# EAGLE design #1 v1 (EAGLE 9.7.0)
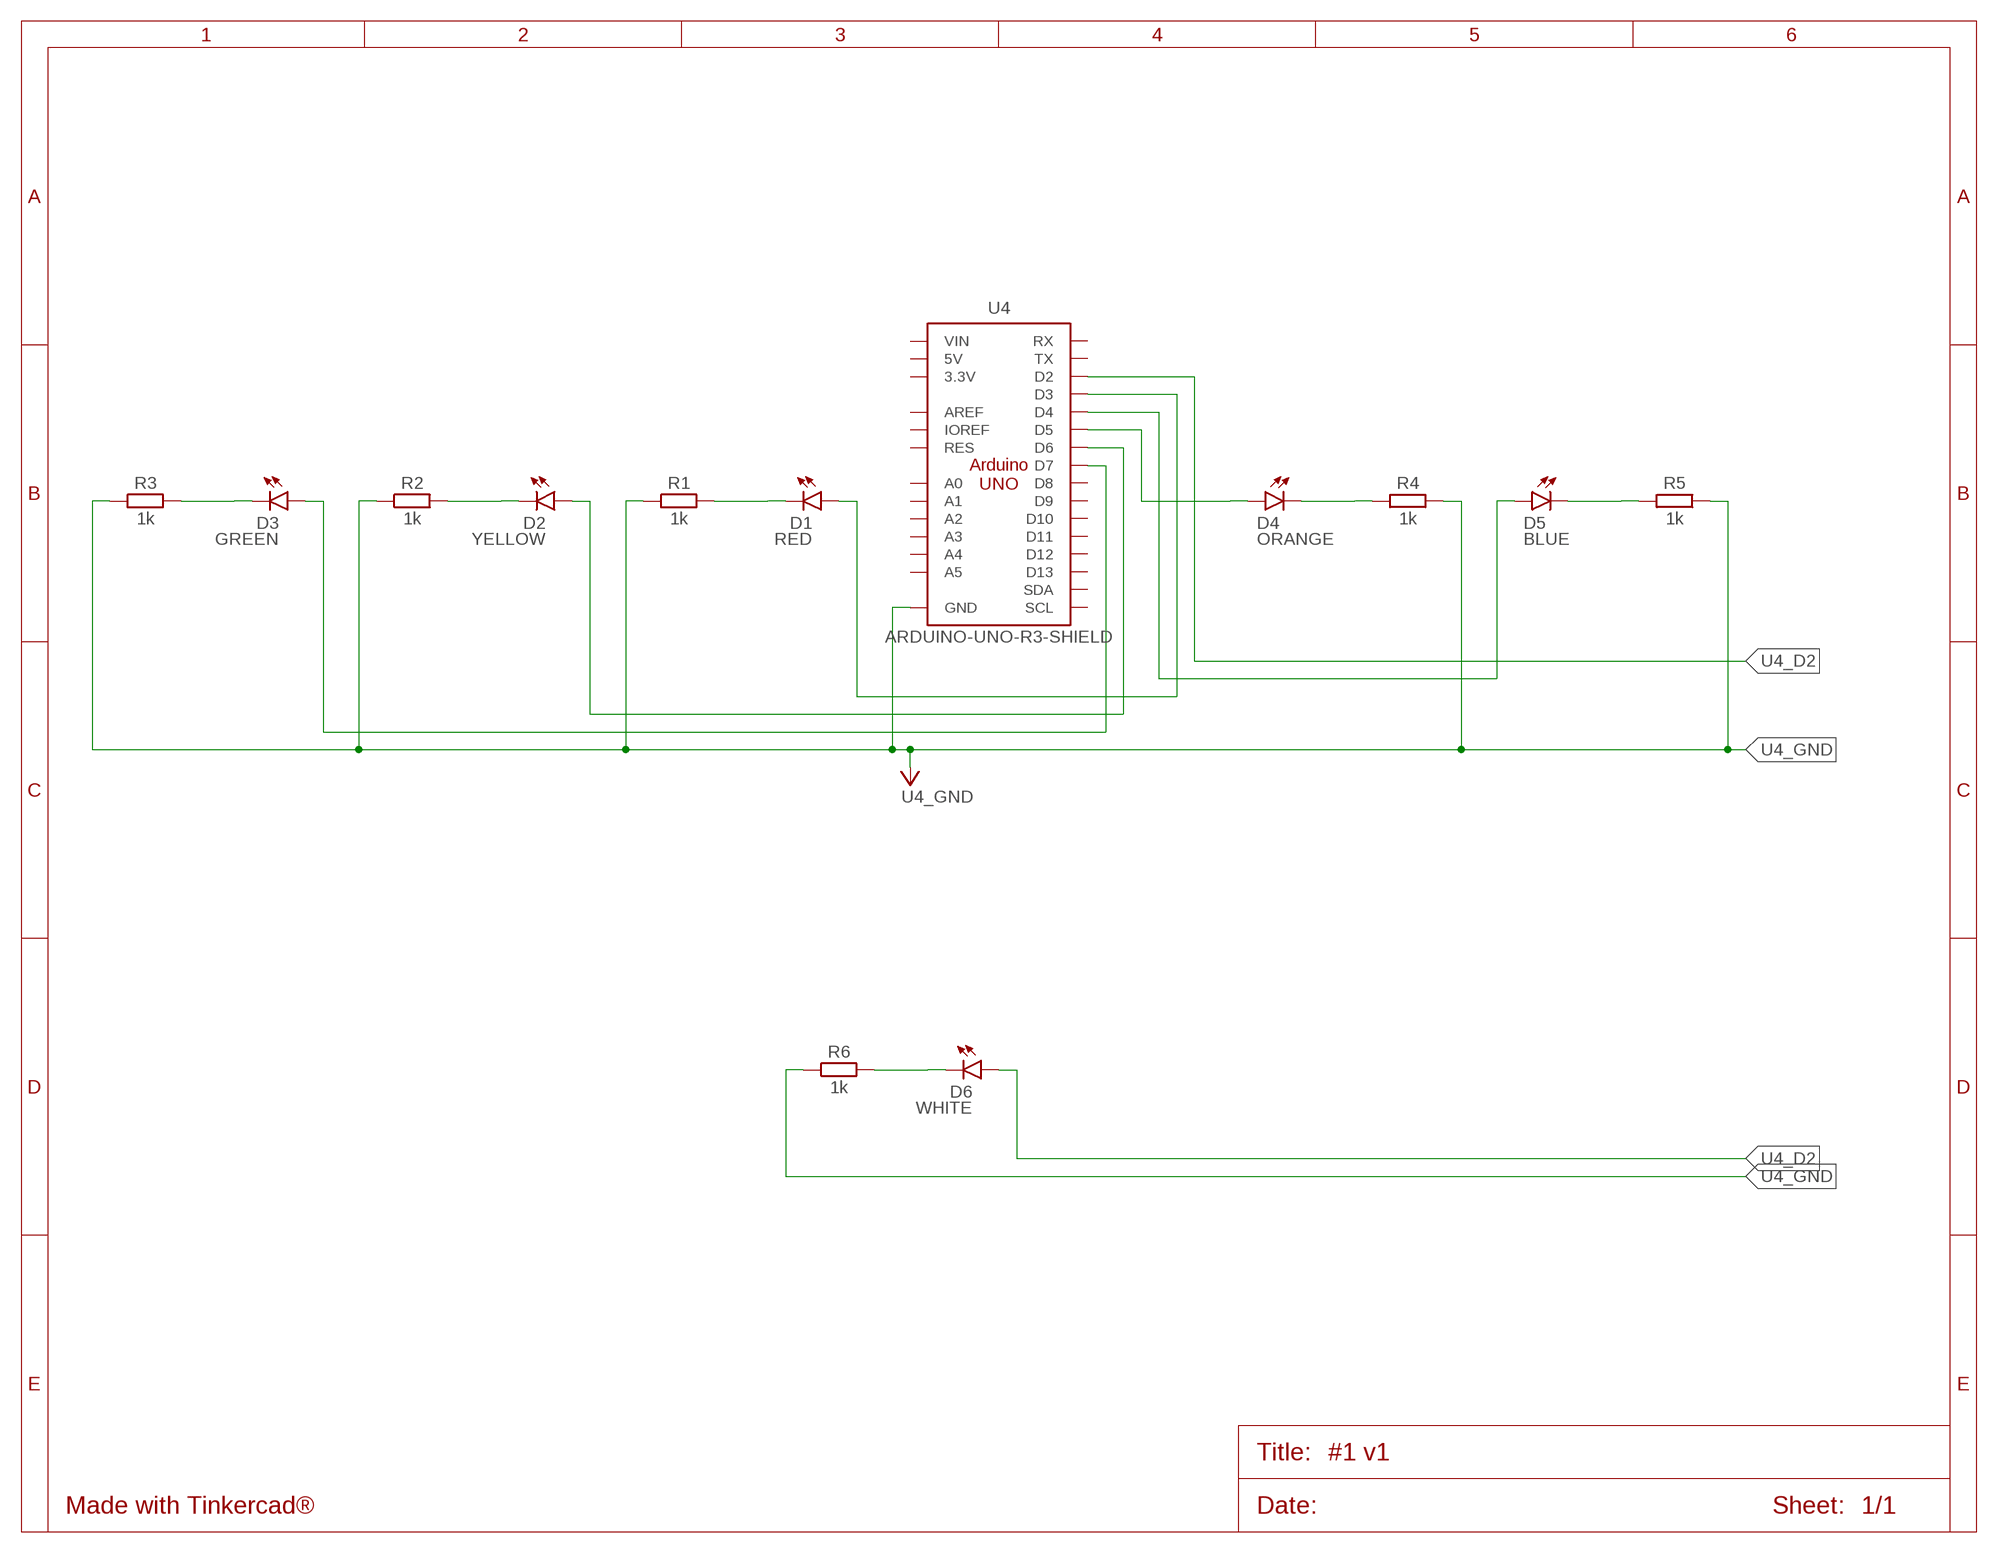
[diagram p0: schematic, sheet 1]

## Parts
D1  RED  LED_RADIAL_RED  [LEDRD254W60D565H860B]
D2  YELLOW  LED_RADIAL_YELLOW  [LEDRD254W60D565H860B_Y]
D3  GREEN  LED_RADIAL_GREEN  [LEDRD254W60D565H860B_G]
D4  ORANGE  LED_RADIAL_ORANGE  [LEDRD254W60D565H860B_O]
D5  BLUE  LED_RADIAL_BLUE  [LEDRD254W60D565H860B_B]
D6  WHITE  LED_RADIAL_WHITE  [LEDRD254W60D565H860B_W]
R1  1k  RESISTOR_AXIAL-10.16MM-PITCH  [RESAD1016W63L850D250B]
R2  1k  RESISTOR_AXIAL-10.16MM-PITCH  [RESAD1016W63L850D250B]
R3  1k  RESISTOR_AXIAL-10.16MM-PITCH  [RESAD1016W63L850D250B]
R4  1k  RESISTOR_AXIAL-10.16MM-PITCH  [RESAD1016W63L850D250B]
R5  1k  RESISTOR_AXIAL-10.16MM-PITCH  [RESAD1016W63L850D250B]
R6  1k  RESISTOR_AXIAL-10.16MM-PITCH  [RESAD1016W63L850D250B]
U4  ARDUINO-UNO-R3-SHIELD  [ARDUINO-UNO-R3-SHIELD]

## Nets
D1_C: D1.2(C) R1.2
D2_C: D2.2(C) R2.2
D3_C: D3.2(C) R3.2
D4_C: D4.2(C) R4.2
D5_C: D5.2(C) R5.2
D6_C: D6.2(C) R6.2
U4_D2: D6.1(A) U4.D2
U4_D3: D1.1(A) U4.D3
U4_D4: D5.1(A) U4.D4
U4_D5: D4.1(A) U4.D5
U4_D6: D2.1(A) U4.D6
U4_D7: D3.1(A) U4.D7
U4_GND: R1.1 R2.1 R3.1 R4.1 R5.1 R6.1 U4.GND@0(GND) U4.GND@1(GND) U4.GND@2(GND)
Unconnected: U4.3.3V U4.5V U4.A0 U4.A1 U4.A2 U4.A3 U4.A4 U4.A5 U4.AREF U4.D8 U4.D9 U4.D10 U4.D11 U4.D12 U4.D13 U4.IOREF U4.RES U4.RX U4.SCL U4.SDA U4.TX U4.VIN

## Library data of the parts
D1 = Tinkercad:LED_RADIAL: LED - Generic; CATEGORY: Opto-Electronic; SUB-CATEGORY: LED; VALUE: LED_RED
D2 = Tinkercad:LED_RADIAL: LED - Generic; CATEGORY: Opto-Electronic; SUB-CATEGORY: LED; VALUE: LED_YELLOW
D3 = Tinkercad:LED_RADIAL: LED - Generic; CATEGORY: Opto-Electronic; SUB-CATEGORY: LED; VALUE: LED_GREEN
D4 = Tinkercad:LED_RADIAL: LED - Generic; CATEGORY: Opto-Electronic; SUB-CATEGORY: LED; VALUE: LED_ORANGE
D5 = Tinkercad:LED_RADIAL: LED - Generic; CATEGORY: Opto-Electronic; SUB-CATEGORY: LED; VALUE: LED_BLUE
D6 = Tinkercad:LED_RADIAL: LED - Generic; CATEGORY: Opto-Electronic; SUB-CATEGORY: LED; VALUE: LED_WHITE
R1-R6 = Tinkercad:RESISTOR: Resistor Fixed - Generic
U4 = Tinkercad:ARDUINO-UNO-R3-SHIELD

## Board
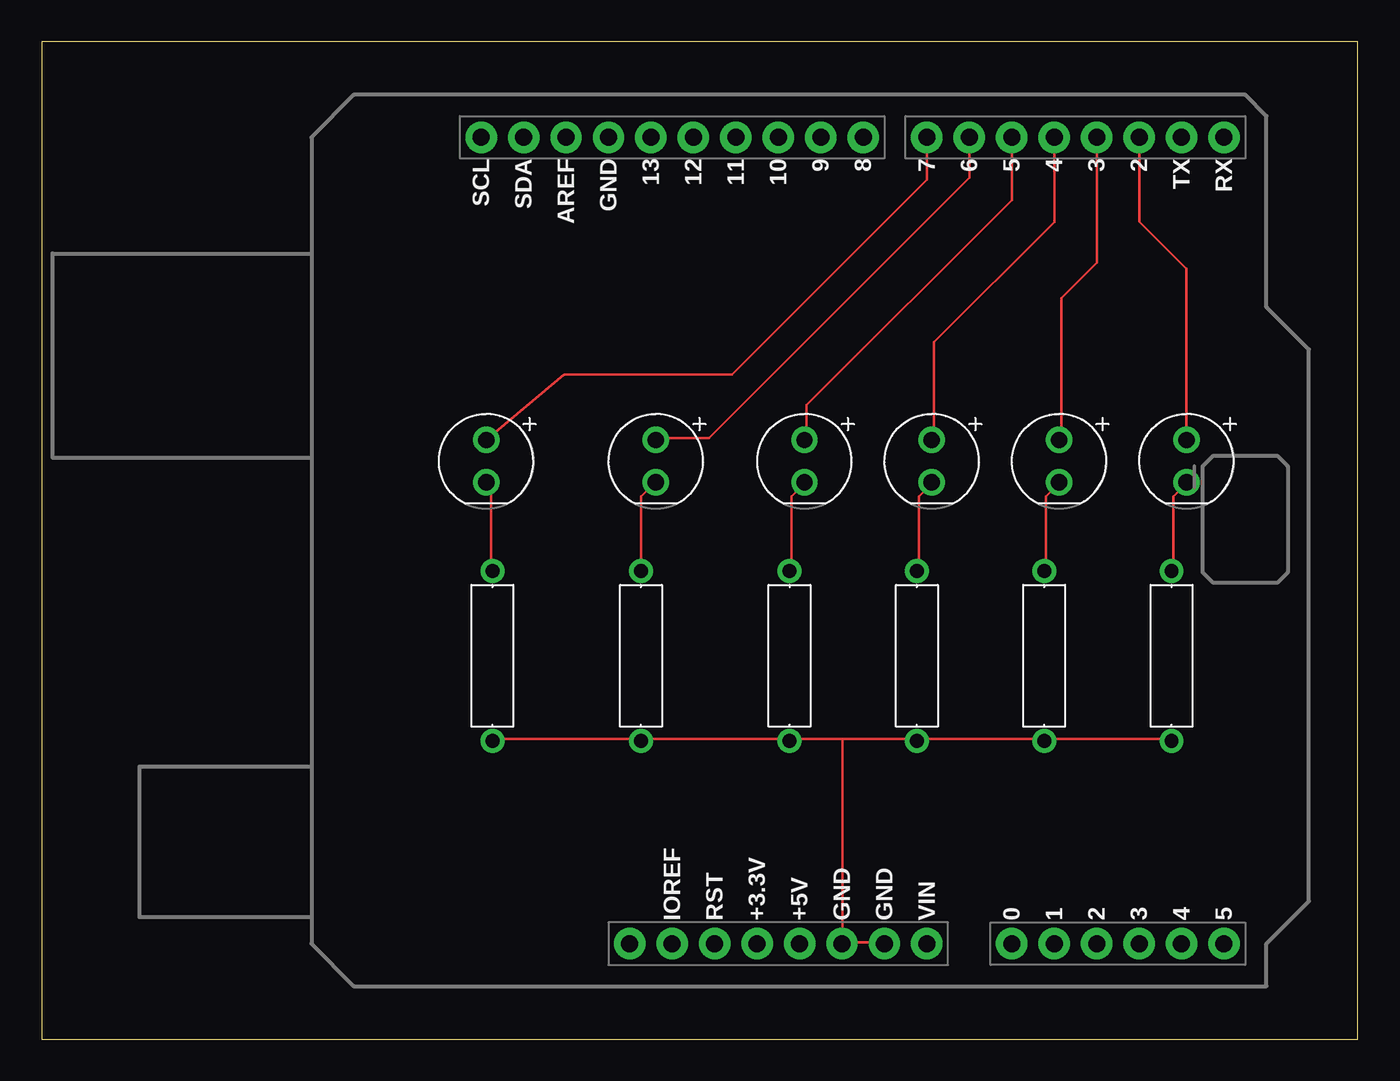
[diagram p1: board, top side]
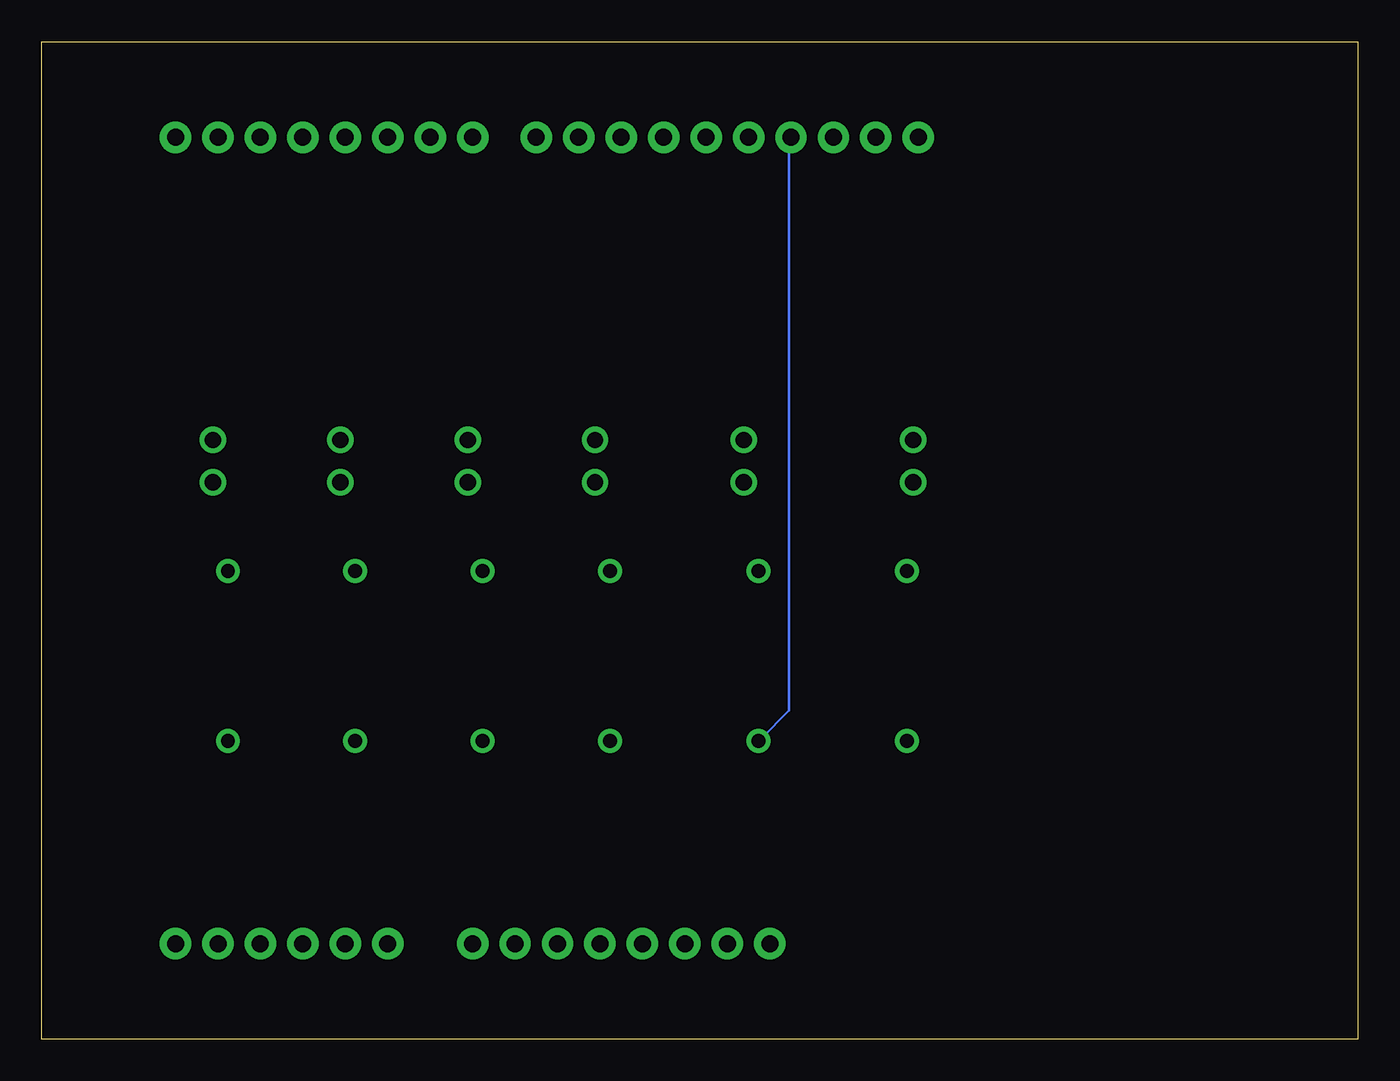
[diagram p2: board, bottom side, seen from below]

Size 78.75 x 59.69 mm. Coordinates in mm from the lower left corner, seen from the top.
Outline: 0,0 78.75,0 78.75,59.69 0,59.69 0,0
Copper layers (1*16): Top 0.035mm / dielectric 1.5mm / Bottom 0.035mm
Design rules "default": minimum track width 6mil, minimum drill 0.35mm, track to track 6mil, track to pad 6mil, pad to pad 6mil, via to via 6mil, smd to smd 6mil, copper to edge 40mil, drill to drill 6mil, minimum pad ring 10mil, minimum via ring 8mil, stop-mask expansion 4mil, vias tented up to drill 0mil, thermal gap 10mil

### Footprints (pad centres in the part's own frame; a part is rotated, then mirrored left to right if it is on the bottom)
LEDRD254W60D565H860B = drill 0.981 pad 1.581: 1 -1.27,0; 2 1.27,0
LEDRD254W60D565H860B_Y = drill 0.981 pad 1.581: 1 -1.27,0; 2 1.27,0
LEDRD254W60D565H860B_G = drill 0.981 pad 1.581: 1 -1.27,0; 2 1.27,0
LEDRD254W60D565H860B_O = drill 0.981 pad 1.581: 1 -1.27,0; 2 1.27,0
LEDRD254W60D565H860B_B = drill 0.981 pad 1.581: 1 -1.27,0; 2 1.27,0
LEDRD254W60D565H860B_W = drill 0.981 pad 1.581: 1 -1.27,0; 2 1.27,0
RESAD1016W63L850D250B = drill 0.83 pad 1.43: 1 -5.08,0; 2 5.08,0
ARDUINO-UNO-R3-SHIELD = drill 1.016 pad 1.88: 3.3V 24.13,-2.54; 5V 24.13,0; A0 24.13,12.7; A1 24.13,15.24; A2 24.13,17.78; A3 24.13,20.32; A4 24.13,22.86; A5 24.13,25.4; AREF -24.13,-13.97; D2 -24.13,20.32; D3 -24.13,17.78; D4 -24.13,15.24; D5 -24.13,12.7; D6 -24.13,10.16; D7 -24.13,7.62; D8 -24.13,3.81; D9 -24.13,1.27; D10 -24.13,-1.27; D11 -24.13,-3.81; D12 -24.13,-6.35; D13 -24.13,-8.89; GND@0 24.13,2.54; GND@1 24.13,5.08; GND@2 -24.13,-11.43; IOREF 24.13,-7.62; NC 24.13,-10.16; RES 24.13,-5.08; RX -24.13,25.4; SCL -24.13,-19.05; SDA -24.13,-16.51; TX -24.13,22.86; VIN 24.13,7.62

### Placement (x,y rotation side)
D1  60.88,34.59 270 top
D2  36.75,34.59 270 top
D3  26.59,34.59 270 top
D4  45.64,34.59 270 top
D5  53.26,34.59 270 top
D6  68.5,34.59 270 top
R1  59.99,22.94 90 top
R2  35.86,22.94 90 top
R3  26.97,22.94 90 top
R4  44.75,22.94 90 top
R5  52.37,22.94 90 top
R6  67.61,22.94 90 top
U4  45.34,29.84 270 top

### Tracks (layer width: path | path; a pad name or v marks a point on that pad's centre or on a via)
D1_C
  Top 0.152: R1.2 60.1,28.04 60.1,32.46 60.86,33.22 D1.2
D2_C
  Top 0.152: R2.2 35.87,28.04 35.87,32.46 36.63,33.22 D2.2
D3_C
  Top 0.152: R3.2 26.87,28.04 26.87,33.07 26.72,33.22 D3.2
D4_C
  Top 0.152: R4.2 44.86,28.04 44.86,32.46 45.62,33.22 D4.2
D5_C
  Top 0.152: R5.2 52.48,28.04 52.48,32.46 53.24,33.22 D5.2
D6_C
  Top 0.152: R6.2 67.72,28.04 67.72,32.46 68.48,33.22 D6.2
U4_D2
  Top 0.152: U4.D2 65.66,48.94 68.48,46.13 68.48,35.97 D6.1
U4_D3
  Top 0.152: U4.D3 63.13,46.46 61.01,44.35 61.01,35.97 D1.1
U4_D4
  Top 0.152: U4.D4 60.59,48.9 53.39,41.71 53.39,35.97 D5.1
U4_D5
  Top 0.152: U4.D5 58.05,50.22 45.77,37.95 45.77,35.97 D4.1
U4_D6
  Top 0.152: U4.D6 55.51,51.54 39.93,35.97 36.78,35.97 D2.1
U4_D7
  Top 0.152: U4.D7 52.97,51.44 41.3,39.78 31.27,39.78 D3.1
U4_GND
  Top 0.152: 47.9,5.79 50.34,5.79 U4.GND@1 | 47.9,17.98 52.32,17.98 R5.1 52.48,17.98 59.94,17.98 R1.1 60.1,17.98 67.56,17.98 R6.1 | 47.9,17.98 44.86,17.98 R4.1 44.7,17.98 35.87,17.98 R2.1 35.71,17.98 27.03,17.98 R3.1 | 47.9,17.98 47.9,5.79 | 47.9,5.79 U4.GND@0
  Bottom 0.152: U4.GND@2 34.04,53.95 34.04,19.66 35.71,17.98 R2.1